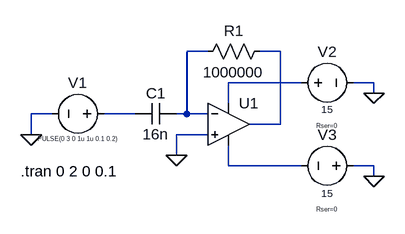
[diagram p0: schematic Diff pulse.asc]
Diff pulse.asc, the LTspice schematic file:
Version 4.1
SHEET 1 880 680
WIRE 192 48 160 48
WIRE 304 48 272 48
WIRE 336 96 224 96
WIRE 448 96 416 96
WIRE 448 112 448 96
WIRE 224 128 224 96
WIRE -48 144 -80 144
WIRE 80 144 32 144
WIRE 160 144 160 48
WIRE 160 144 144 144
WIRE 192 144 160 144
WIRE 304 160 304 48
WIRE 304 160 256 160
WIRE -80 176 -80 144
WIRE 192 176 144 176
WIRE 144 208 144 176
WIRE 224 224 224 192
WIRE 336 224 224 224
WIRE 448 224 416 224
WIRE 448 240 448 224
FLAG 144 208 0
FLAG -80 176 0
FLAG 448 112 0
FLAG 448 240 0
SYMBOL cap 144 128 R90
WINDOW 0 0 32 VBottom 2
WINDOW 3 32 32 VTop 2
SYMATTR InstName C1
SYMATTR Value 16n
SYMBOL res 288 32 R90
WINDOW 0 0 56 VBottom 2
WINDOW 3 32 56 VTop 2
SYMATTR InstName R1
SYMATTR Value 1000000
SYMBOL voltage 48 144 R90
WINDOW 0 -32 56 VBottom 2
WINDOW 3 32 56 VTop 0
WINDOW 123 0 0 Left 0
WINDOW 39 0 0 Left 0
SYMATTR InstName V1
SYMATTR Value PULSE(0 3 0 1u 1u 0.1 0.2)
SYMBOL OpAmps\\UniversalOpAmp2 224 160 R0
SYMATTR InstName U1
SYMATTR Value2 Avol=100k GBW=1Meg Slew=1Meg
SYMBOL voltage 320 96 R270
WINDOW 0 32 56 VTop 2
WINDOW 3 -51 56 VTop 1
WINDOW 123 0 0 Left 0
WINDOW 39 -60 56 VBottom 0
SYMATTR InstName V2
SYMATTR Value 15
SYMATTR SpiceLine Rser=0
SYMBOL voltage 432 224 R90
WINDOW 0 -32 56 VBottom 2
WINDOW 3 32 56 VTop 1
WINDOW 123 0 0 Left 0
WINDOW 39 60 56 VTop 0
SYMATTR InstName V3
SYMATTR Value 15
SYMATTR SpiceLine Rser=0
TEXT -96 232 Left 2 !.tran 0 2 0 0.1

The netlist it stands for:
* Diff pulse.asc
C1 N001 N004 16n
R1 N002 N001 1000000
V1 N004 0 PULSE(0 3 0 1u 1u 0.1 0.2)
X§U1 0 N001 N003 N005 N002 level2 Avol=100k GBW=1Meg Slew=1Meg Ilimit=25m Rail=0 Vos=0 En=0 Enk=0 In=0 Ink=0 Rin=500Meg  ; pins In+ In- V+ V- OUT
V2 N003 0 15 Rser=0
V3 0 N005 15 Rser=0
.tran 0 2 0 0.1
.lib UniversalOpAmp2.lib
.backanno
.end